# EAGLE design LuMini_2Inch (EAGLE 9.1.0)
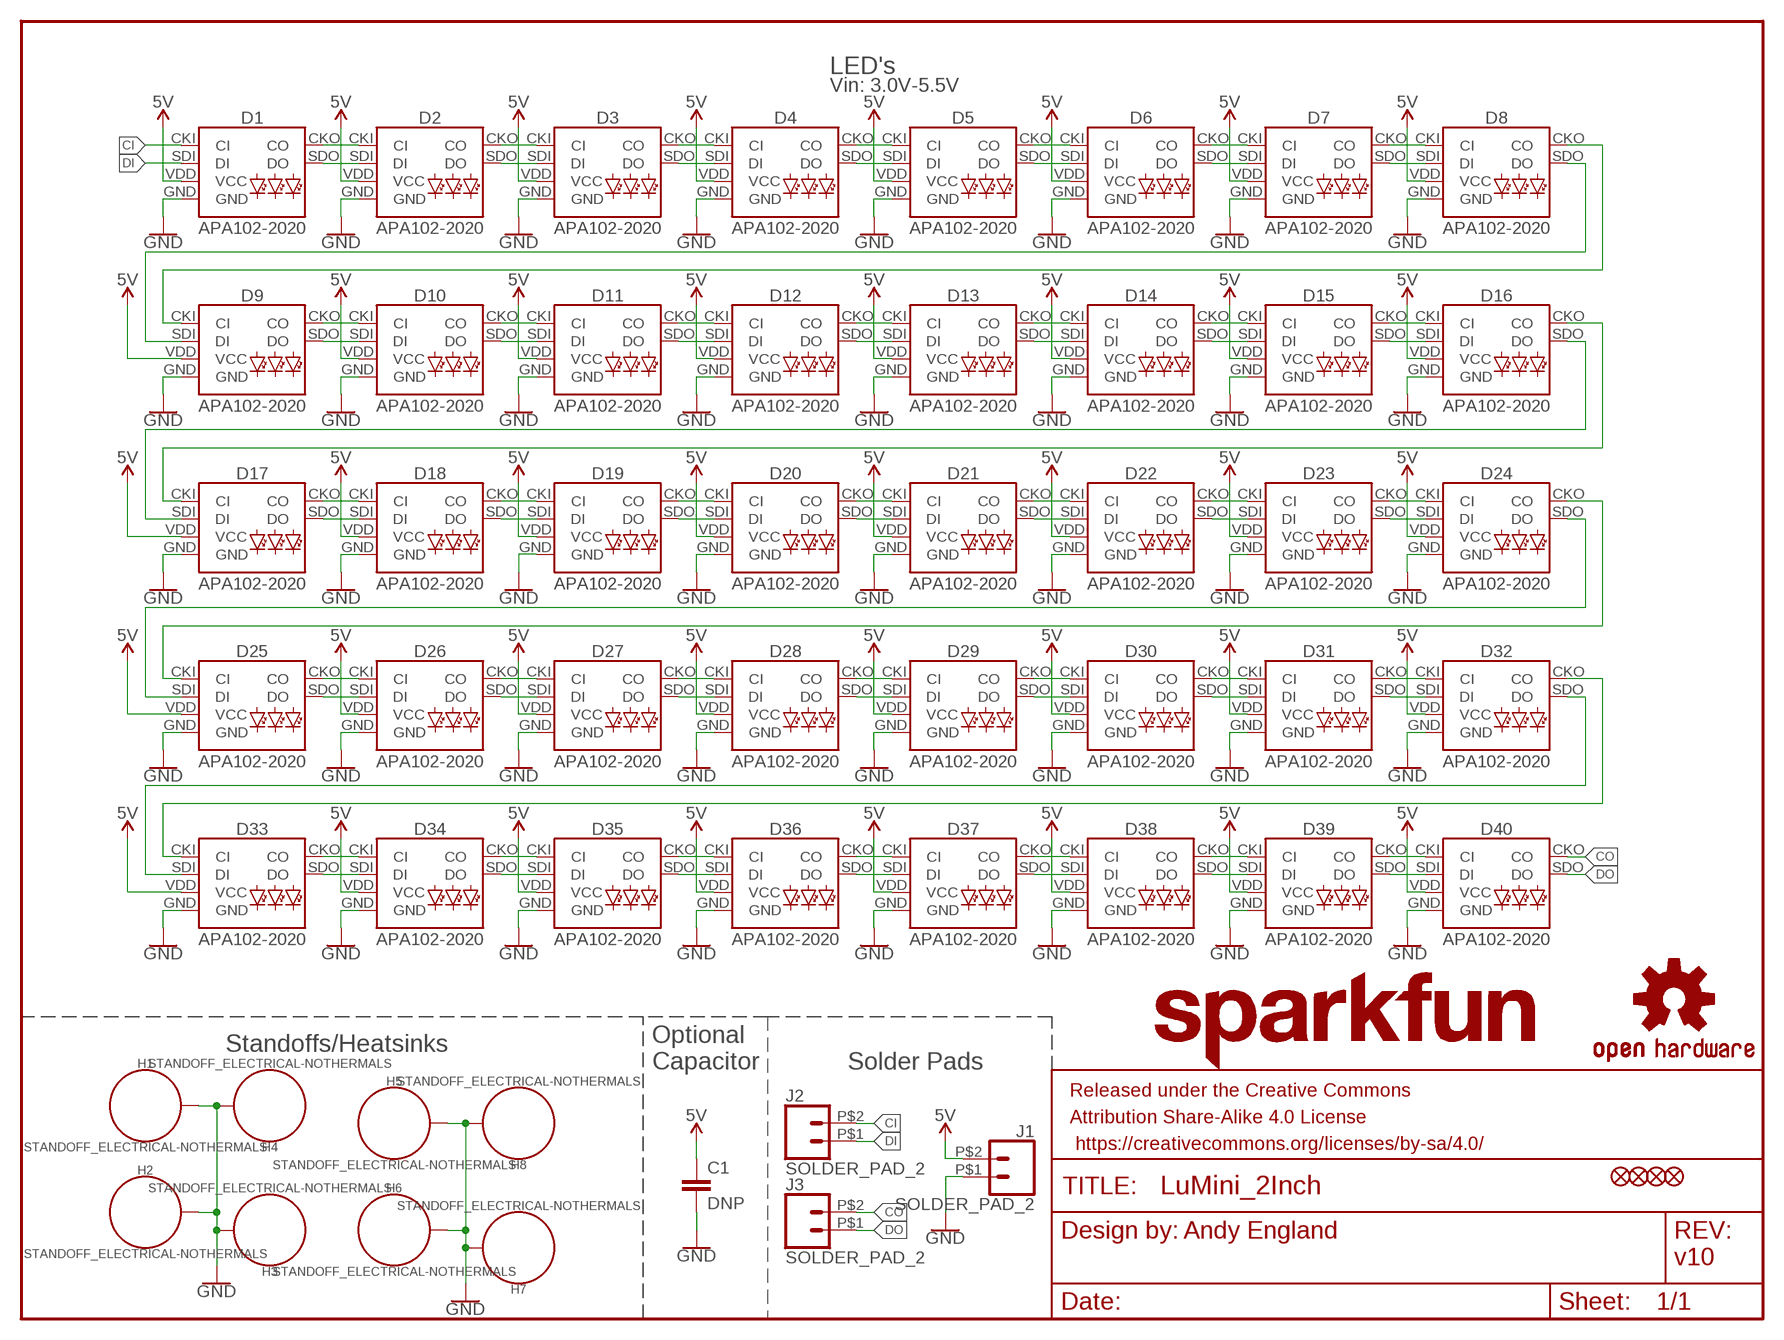
[diagram p0: schematic, sheet 1]

## Parts
C1  DNP  4.7UF-1206-16V-(+80/-20%)  [1206]
D1  APA102-2020  [APA102-2020]
D2  APA102-2020  [APA102-2020]
D3  APA102-2020  [APA102-2020]
D4  APA102-2020  [APA102-2020]
D5  APA102-2020  [APA102-2020]
D6  APA102-2020  [APA102-2020]
D7  APA102-2020  [APA102-2020]
D8  APA102-2020  [APA102-2020]
D9  APA102-2020  [APA102-2020]
D10  APA102-2020  [APA102-2020]
D11  APA102-2020  [APA102-2020]
D12  APA102-2020  [APA102-2020]
D13  APA102-2020  [APA102-2020]
D14  APA102-2020  [APA102-2020]
D15  APA102-2020  [APA102-2020]
D16  APA102-2020  [APA102-2020]
D17  APA102-2020  [APA102-2020]
D18  APA102-2020  [APA102-2020]
D19  APA102-2020  [APA102-2020]
D20  APA102-2020  [APA102-2020]
D21  APA102-2020  [APA102-2020]
D22  APA102-2020  [APA102-2020]
D23  APA102-2020  [APA102-2020]
D24  APA102-2020  [APA102-2020]
D25  APA102-2020  [APA102-2020]
D26  APA102-2020  [APA102-2020]
D27  APA102-2020  [APA102-2020]
D28  APA102-2020  [APA102-2020]
D29  APA102-2020  [APA102-2020]
D30  APA102-2020  [APA102-2020]
D31  APA102-2020  [APA102-2020]
D32  APA102-2020  [APA102-2020]
D33  APA102-2020  [APA102-2020]
D34  APA102-2020  [APA102-2020]
D35  APA102-2020  [APA102-2020]
D36  APA102-2020  [APA102-2020]
D37  APA102-2020  [APA102-2020]
D38  APA102-2020  [APA102-2020]
D39  APA102-2020  [APA102-2020]
D40  APA102-2020  [APA102-2020]
FD1  FIDUCIALUFIDUCIAL  [FIDUCIAL-MICRO]
FD2  FIDUCIALUFIDUCIAL  [FIDUCIAL-MICRO]
FD3  FIDUCIALUFIDUCIAL  [FIDUCIAL-MICRO]
FD4  FIDUCIALUFIDUCIAL  [FIDUCIAL-MICRO]
FRAME1  FRAME-LETTER  [CREATIVE_COMMONS]
H1  STANDOFF_ELECTRICAL-NOTHERMALS  [STANDOFF-ELECTRICAL-NOTHERMALS]
H2  STANDOFF_ELECTRICAL-NOTHERMALS  [STANDOFF-ELECTRICAL-NOTHERMALS]
H3  STANDOFF_ELECTRICAL-NOTHERMALS  [STANDOFF-ELECTRICAL-NOTHERMALS]
H4  STANDOFF_ELECTRICAL-NOTHERMALS  [STANDOFF-ELECTRICAL-NOTHERMALS]
H5  STANDOFF_ELECTRICAL-NOTHERMALS  [STANDOFF-ELECTRICAL-NOTHERMALS]
H6  STANDOFF_ELECTRICAL-NOTHERMALS  [STANDOFF-ELECTRICAL-NOTHERMALS]
H7  STANDOFF_ELECTRICAL-NOTHERMALS  [STANDOFF-ELECTRICAL-NOTHERMALS]
H8  STANDOFF_ELECTRICAL-NOTHERMALS  [STANDOFF-ELECTRICAL-NOTHERMALS]
J1  SOLDER_PAD_2  [SOLDER_PAD_2]
J2  SOLDER_PAD_2  [SOLDER_PAD_2]
J3  SOLDER_PAD_2  [SOLDER_PAD_2]
LOGO1  OSHW-LOGOS  [OSHW-LOGO-S]
LOGO2  SFE_LOGO_NAME.1_INCH  [SFE_LOGO_NAME_.1]

## Nets
5V: C1.1 D1.VDD(VCC) D2.VDD(VCC) D3.VDD(VCC) D4.VDD(VCC) D5.VDD(VCC) D6.VDD(VCC) D7.VDD(VCC) D8.VDD(VCC) D9.VDD(VCC) D10.VDD(VCC) D11.VDD(VCC) D12.VDD(VCC) D13.VDD(VCC) D14.VDD(VCC) D15.VDD(VCC) D16.VDD(VCC) D17.VDD(VCC) D18.VDD(VCC) D19.VDD(VCC) D20.VDD(VCC) D21.VDD(VCC) D22.VDD(VCC) D23.VDD(VCC) D24.VDD(VCC) D25.VDD(VCC) D26.VDD(VCC) D27.VDD(VCC) D28.VDD(VCC) D29.VDD(VCC) D30.VDD(VCC) D31.VDD(VCC) D32.VDD(VCC) D33.VDD(VCC) D34.VDD(VCC) D35.VDD(VCC) D36.VDD(VCC) D37.VDD(VCC) D38.VDD(VCC) D39.VDD(VCC) D40.VDD(VCC) J1.P$2
CI: D1.CKI(CI) J2.P$2
CO: D40.CKO(CO) J3.P$2
DI: D1.SDI(DI) J2.P$1
DO: D40.SDO(DO) J3.P$1
GND: C1.2 D1.GND D2.GND D3.GND D4.GND D5.GND D6.GND D7.GND D8.GND D9.GND D10.GND D11.GND D12.GND D13.GND D14.GND D15.GND D16.GND D17.GND D18.GND D19.GND D20.GND D21.GND D22.GND D23.GND D24.GND D25.GND D26.GND D27.GND D28.GND D29.GND D30.GND D31.GND D32.GND D33.GND D34.GND D35.GND D36.GND D37.GND D38.GND D39.GND D40.GND H1.P1 H2.P1 H3.P1 H4.P1 H5.P1 H6.P1 H7.P1 H8.P1 J1.P$1
N$1: D4.CKO(CO) D5.CKI(CI)
N$4: D1.CKO(CO) D2.CKI(CI)
N$5: D1.SDO(DO) D2.SDI(DI)
N$6: D2.CKO(CO) D3.CKI(CI)
N$7: D2.SDO(DO) D3.SDI(DI)
N$8: D3.CKO(CO) D4.CKI(CI)
N$9: D3.SDO(DO) D4.SDI(DI)
N$10: D4.SDO(DO) D5.SDI(DI)
N$11: D5.CKO(CO) D6.CKI(CI)
N$12: D5.SDO(DO) D6.SDI(DI)
N$13: D6.CKO(CO) D7.CKI(CI)
N$14: D6.SDO(DO) D7.SDI(DI)
N$15: D7.CKO(CO) D8.CKI(CI)
N$16: D7.SDO(DO) D8.SDI(DI)
N$17: D24.CKO(CO) D25.CKI(CI)
N$19: D9.CKO(CO) D10.CKI(CI)
N$20: D9.SDO(DO) D10.SDI(DI)
N$21: D10.CKO(CO) D11.CKI(CI)
N$22: D10.SDO(DO) D11.SDI(DI)
N$23: D11.CKO(CO) D12.CKI(CI)
N$24: D11.SDO(DO) D12.SDI(DI)
N$25: D12.CKO(CO) D13.CKI(CI)
N$26: D12.SDO(DO) D13.SDI(DI)
N$27: D13.CKO(CO) D14.CKI(CI)
N$28: D13.SDO(DO) D14.SDI(DI)
N$29: D14.CKO(CO) D15.CKI(CI)
N$30: D14.SDO(DO) D15.SDI(DI)
N$31: D15.CKO(CO) D16.CKI(CI)
N$32: D15.SDO(DO) D16.SDI(DI)
N$35: D17.CKO(CO) D18.CKI(CI)
N$36: D17.SDO(DO) D18.SDI(DI)
N$37: D18.CKO(CO) D19.CKI(CI)
N$38: D18.SDO(DO) D19.SDI(DI)
N$39: D19.CKO(CO) D20.CKI(CI)
N$40: D19.SDO(DO) D20.SDI(DI)
N$41: D20.CKO(CO) D21.CKI(CI)
N$42: D20.SDO(DO) D21.SDI(DI)
N$43: D16.SDO(DO) D17.SDI(DI)
N$44: D16.CKO(CO) D17.CKI(CI)
N$45: D8.SDO(DO) D9.SDI(DI)
N$47: D24.SDO(DO) D25.SDI(DI)
N$48: D21.CKO(CO) D22.CKI(CI)
N$49: D21.SDO(DO) D22.SDI(DI)
N$50: D22.CKO(CO) D23.CKI(CI)
N$51: D22.SDO(DO) D23.SDI(DI)
N$52: D23.CKO(CO) D24.CKI(CI)
N$53: D23.SDO(DO) D24.SDI(DI)
N$54: D32.SDO(DO) D33.SDI(DI)
N$55: D32.CKO(CO) D33.CKI(CI)
N$56: D25.CKO(CO) D26.CKI(CI)
N$57: D25.SDO(DO) D26.SDI(DI)
N$58: D26.CKO(CO) D27.CKI(CI)
N$59: D26.SDO(DO) D27.SDI(DI)
N$60: D27.CKO(CO) D28.CKI(CI)
N$61: D27.SDO(DO) D28.SDI(DI)
N$62: D28.CKO(CO) D29.CKI(CI)
N$63: D28.SDO(DO) D29.SDI(DI)
N$66: D29.CKO(CO) D30.CKI(CI)
N$67: D29.SDO(DO) D30.SDI(DI)
N$68: D30.CKO(CO) D31.CKI(CI)
N$69: D30.SDO(DO) D31.SDI(DI)
N$70: D31.CKO(CO) D32.CKI(CI)
N$71: D31.SDO(DO) D32.SDI(DI)
N$74: D33.CKO(CO) D34.CKI(CI)
N$75: D33.SDO(DO) D34.SDI(DI)
N$76: D34.CKO(CO) D35.CKI(CI)
N$77: D34.SDO(DO) D35.SDI(DI)
N$78: D35.CKO(CO) D36.CKI(CI)
N$79: D35.SDO(DO) D36.SDI(DI)
N$80: D36.CKO(CO) D37.CKI(CI)
N$81: D36.SDO(DO) D37.SDI(DI)
N$84: D37.CKO(CO) D38.CKI(CI)
N$85: D37.SDO(DO) D38.SDI(DI)
N$86: D38.CKO(CO) D39.CKI(CI)
N$87: D38.SDO(DO) D39.SDI(DI)
N$88: D39.CKO(CO) D40.CKI(CI)
N$89: D39.SDO(DO) D40.SDI(DI)
N$98: D8.CKO(CO) D9.CKI(CI)

## Notes on the sheet
- LED's
- Vin: 3.0V-5.5V
- Standoffs/Heatsinks
- Optional
  Capacitor
- Solder Pads
- Andy England
- v10

## Library data of the parts
C1 = SparkFun-Capacitors:4.7UF: 4.7µF ceramic capacitors A capacitor is a passive two-terminal electrical component used to store electrical energy temporarily in an electric field.; PROD_ID: CAP-10300; VALUE: 4.7uF
D1-D40 = SparkFun-LED:APA102: APA102 Addressable RGB LED Used in manufacturing of various products at SparkFun Packages: 5050 2020 SparkFun Products: SparkFun Lumenati Boards <https://www.sparkfun.com/categories/405>; PROD_ID: DIO-13883
FD1-FD4 = SparkFun-Aesthetics:FIDUCIAL: Fiducial Alignment Points Point-of-reference for pick-and-place machines and other optical instruments.
FRAME1 = SparkFun-Aesthetics:FRAME-LETTER: Schematic Frame - Letter Standard 8.5x11 US Letter frame
H1-H8 = SparkFun-Hardware:STANDOFF_ELECTRICAL: Stand Off Drill holes with an electrical connection. For example, use these to ground your board to a chassis. Example SparkFun Products Screw - Phillips Head (1/4", 4-40, 10 pack) <https://www.sparkfun.com/products/10453> (PRT-10453) Screw - Phillips Head (1/2", 4-40, 10 pack) <https://www.sparkfun.com/products/10452> (PRT-10452) Screw - Phillips Head (3/4", 4-40, 10 pack) <https://www.sparkfun.com/products/10451> (PRT-10451) Screw - Phillips Head (1", 4-40, 10 pack) <https://www.sparkfun.com/products/10450> (PRT-10450)
J1-J3 = SparkFun-Connectors:SOLDER_PAD_2: Solder Pad for LuMini Rings
LOGO1 = SparkFun-Aesthetics:OSHW-LOGO: Open-Source Hardware (OSHW) Logo This logo indicates the piece of hardware it is found on incorporates a OSHW license and/or adheres to the definition of open source hardware found here: http://freedomdefined.org/OSHW
LOGO2 = SparkFun-Aesthetics:SFE_LOGO_NAME: SparkFun Font Logo This is the SparkFun name logo. The logo on the schematic will always be the same size; the package variant is the height of the flame part of the logo (or the height the flame would be, if it were drawn). Default layer for the logo on the board is tSilk.

## Board
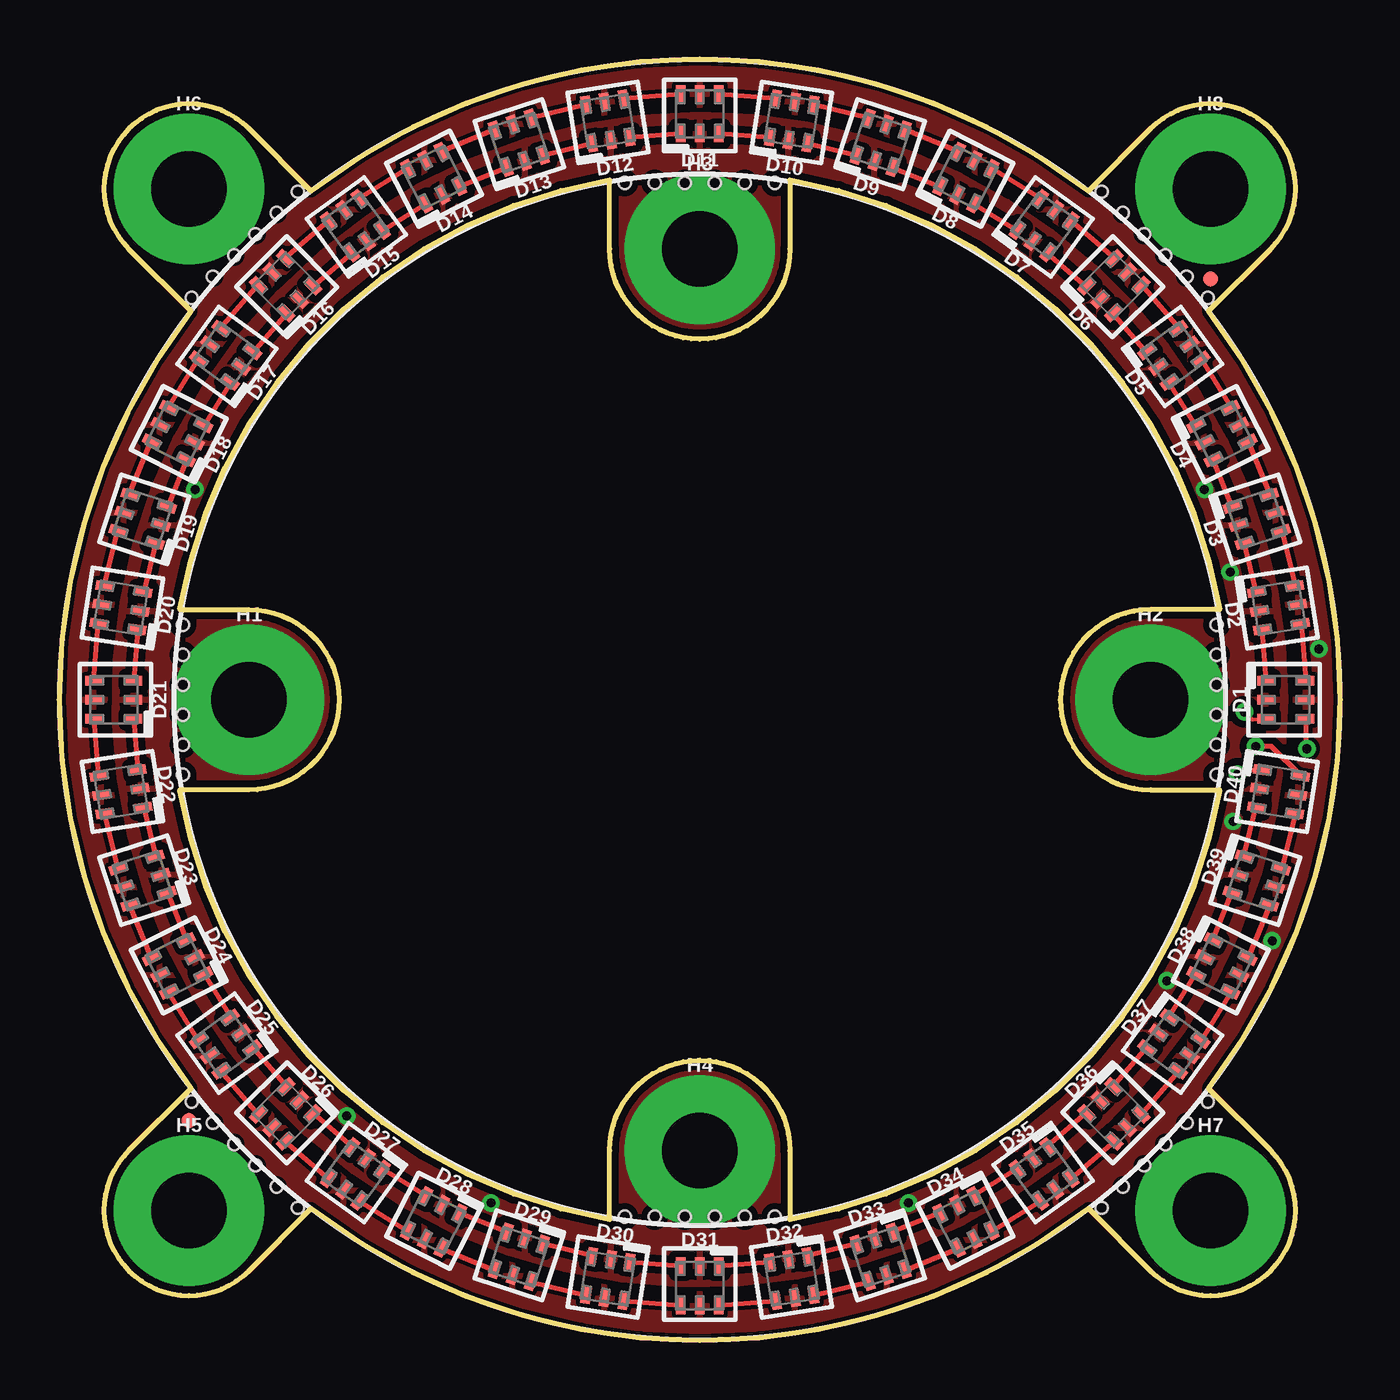
[diagram p1: board, top side]
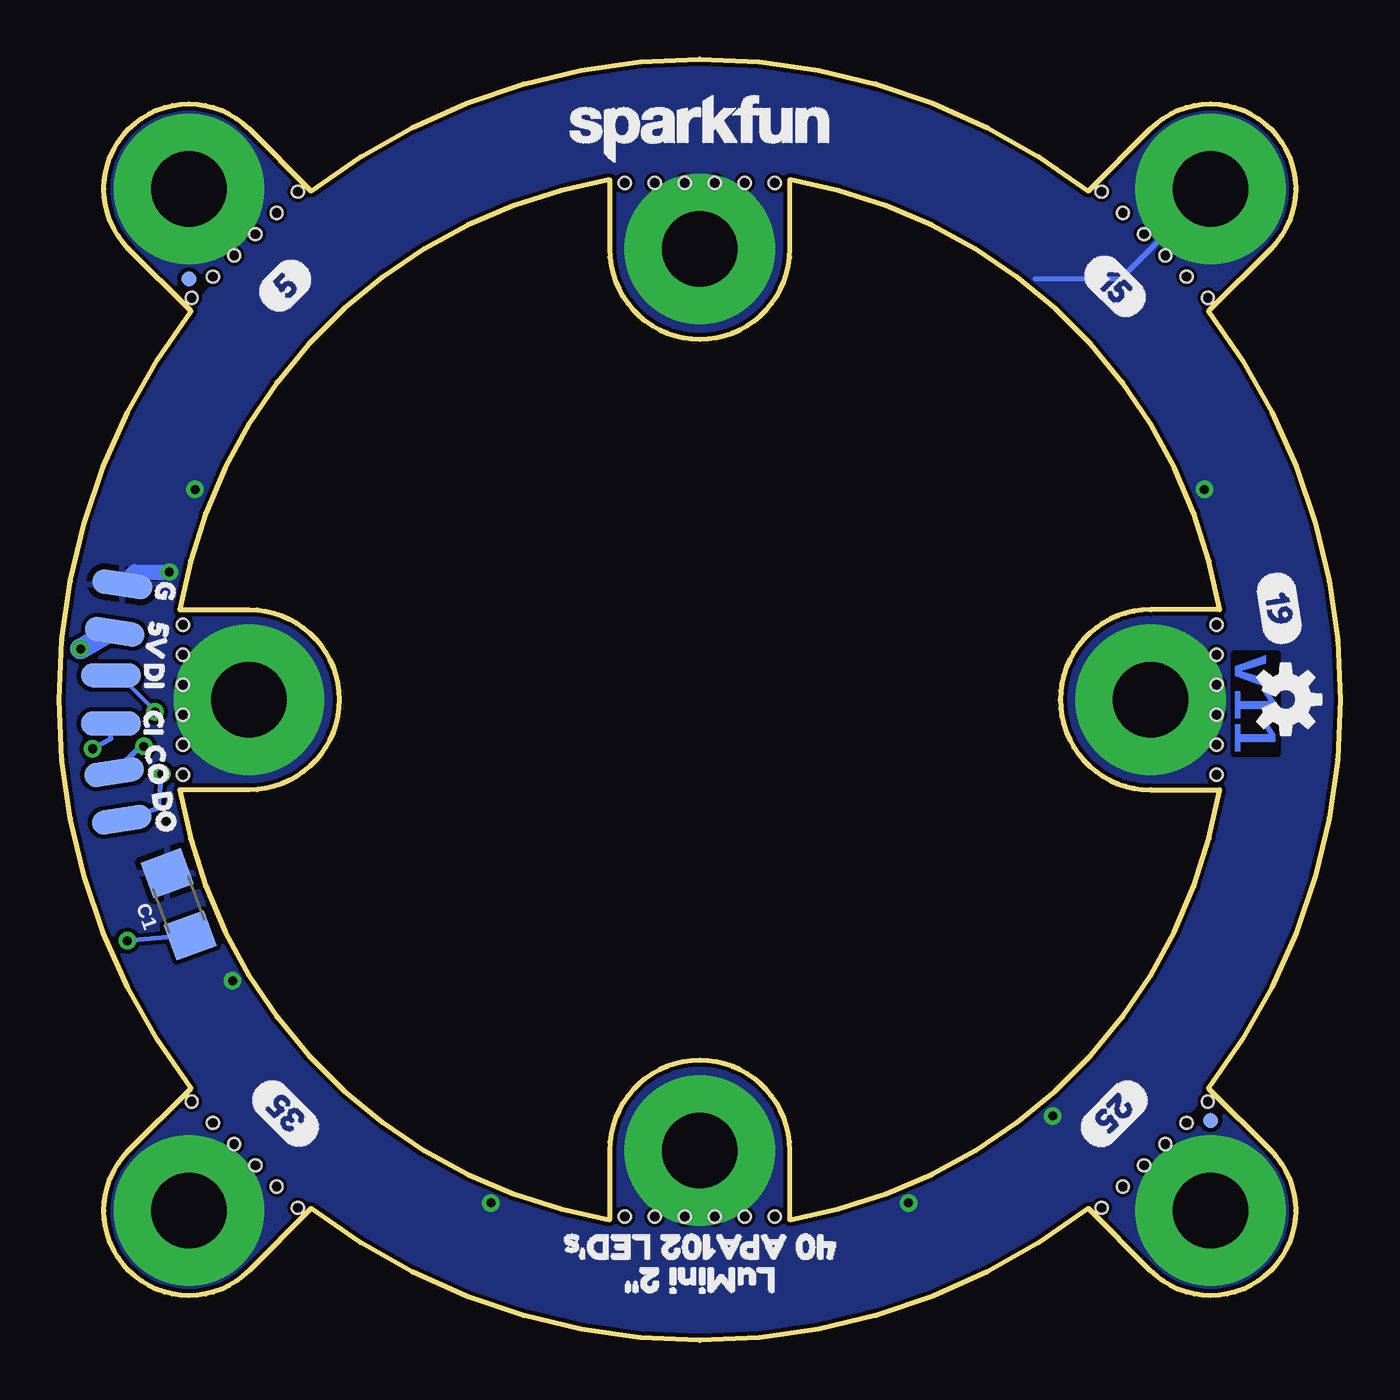
[diagram p2: board, bottom side, seen from below]

Size 54.15 x 54.15 mm. Coordinates in mm from the lower left corner, seen from the top.
Outline: 5.1,30.89 8.03,30.89 arc-90 11.84,27.08 arc-90 8.03,23.27 5.1,23.27 arc71 23.27,5.1 23.27,8.03 arc-90 27.08,11.84 arc-90 30.89,8.03 30.89,5.1 arc71 49.05,23.27 46.13,23.27 arc-90 42.32,27.08 arc-90 46.13,30.89 49.05,30.89 arc71 30.89,49.05 30.89,46.13 arc-90 27.08,42.32 arc-90 23.27,46.13 23.27,49.05 arc71 5.1,30.89
Outline: 10.65,48.58 8.03,51.21 arc180 2.95,46.13 5.57,43.5 arc75 5.57,10.65 2.95,8.03 arc180 8.03,2.95 10.65,5.57 arc75 43.5,5.57 46.13,2.95 arc180 51.21,8.03 48.58,10.65 arc75 48.58,43.5 51.21,46.13 arc180 46.13,51.21 43.5,48.58 arc75 10.65,48.58
Copper layers (1*16): Top 0.035mm / dielectric 1.5mm / Bottom 0.035mm
Design rules "SparkFun-2-layer-TIGHT": minimum track width 7mil, minimum drill 15mil, track to track 7mil, track to pad 7mil, pad to pad 7mil, via to via 7mil, smd to smd 7mil, copper to edge 7mil, drill to drill 7mil, minimum pad ring 7mil, minimum via ring 7mil, stop-mask expansion 4mil, vias tented up to drill 25mil, thermal gap 10mil
Holes 0.51 mm at 48.92,26.44 48.92,25.17 48.92,23.9 48.92,27.71 48.92,28.98 48.92,30.25 27.71,48.92 28.98,48.92 30.25,48.92 26.44,48.92 25.17,48.92 23.9,48.92 5.23,27.71 5.23,28.98 5.23,30.25 5.23,26.44 5.23,25.17 5.23,23.9 26.44,5.23 25.17,5.23 23.9,5.23 27.71,5.23 28.98,5.23 30.25,5.23 7.4,8.29 6.5,9.19 5.6,10.09 8.29,7.4 9.19,6.5 10.09,5.6 45.86,7.4 44.96,6.5 44.06,5.6 46.75,8.29 47.65,9.19 48.55,10.09 46.75,45.86 47.65,44.96 48.55,44.06 45.86,46.75 44.96,47.65 44.06,48.55 8.29,46.75 9.19,47.65 10.09,48.55 7.4,45.86 6.5,44.96 5.6,44.06

### Footprints (pad centres in the part's own frame; a part is rotated, then mirrored left to right if it is on the bottom)
1206 = smd 1.6 x 1.8: 1 -1.4,0; 2 1.4,0
APA102-2020 = smd 0.4 x 0.7: CKI -0.8,-0.85; CKO 0.8,-0.85; GND 0,0.85; SDI -0.8,0.85; SDO 0.8,0.85; VDD 0,-0.85
FIDUCIAL-MICRO = smd 0.635 x 0.635: 1 0,0
STANDOFF-ELECTRICAL-NOTHERMALS = drill 3.2 pad 6.35: P1 0,0
SOLDER_PAD_2 = smd 1.016 x 2.54: P$1 -1.016,0; P$2 1.016,0

### Placement (x,y rotation side)
C1  49.1,18.43 110 bottom
D1  51.84,27.08 90 top
D2  51.54,30.96 99 top
D3  50.62,34.72 108 top
D4  49.15,38.33 117 top
D5  47.12,41.63 126 top
D6  44.58,44.58 135 top
D7  41.63,47.12 144 top
D8  38.33,49.15 153 top
D9  34.72,50.62 162 top
D10  30.96,51.54 171 top
D11  27.08,51.84 180 top
D12  23.19,51.54 189 top
D13  19.43,50.62 198 top
D14  15.82,49.15 207 top
D15  12.52,47.12 216 top
D16  9.57,44.58 225 top
D17  7.03,41.63 234 top
D18  5,38.33 243 top
D19  3.53,34.72 252 top
D20  2.62,30.96 261 top
D21  2.31,27.08 270 top
D22  2.62,23.19 279 top
D23  3.53,19.43 288 top
D24  5,15.82 297 top
D25  7.03,12.52 306 top
D26  9.57,9.57 315 top
D27  12.52,7.03 324 top
D28  15.82,5 333 top
D29  19.43,3.53 342 top
D30  23.19,2.62 351 top
D31  27.08,2.31 0 top
D32  30.96,2.62 9 top
D33  34.72,3.53 18 top
D34  38.33,5 27 top
D35  41.63,7.03 36 top
D36  44.58,9.57 45 top
D37  47.12,12.52 54 top
D38  49.15,15.82 63 top
D39  50.62,19.43 72 top
D40  51.54,23.19 81 top
FD1  5.49,9.3 0 top
FD2  5.49,9.3 0 bottom
FD3  48.67,44.86 0 top
FD4  48.67,44.86 0 bottom
FRAME1  2.95,-7.21 0 top  (outside the outline)
H1  8.03,27.08 0 top
H2  46.13,27.08 0 top
H3  27.08,46.13 0 top
H4  27.08,8.03 0 top
H5  5.49,5.49 0 top
H6  5.49,48.67 0 top
H7  48.67,5.49 0 top
H8  48.67,48.67 0 top
J1  51.64,30.95 261 bottom
J2  51.97,27.09 270 bottom
J3  51.66,23.01 99 bottom
LOGO1  2.31,27.09 270 bottom
LOGO2  27.08,51.21 0 bottom
U$1  [LUMINI_2#0]  22.95,2.54 180 bottom
U$2  [54]  45.63,43.55 45 bottom
U$3  [156]  10.64,45.67 315 bottom
U$4  [5V6]  49.81,31.08 262 bottom
U$5  [G4]  49.49,32.79 262 bottom
U$6  [194]  2.83,32.5 279 bottom
U$7  [DO3]  49.94,23.9 279 bottom
U$8  [CO1]  50.25,25.87 279 bottom
U$9  [CI6]  50.15,27.37 270 bottom
U$10  [DI4]  50.13,29.36 270 bottom
U$11  [40_APA102_LED#S1]  20.41,3.94 180 bottom
U$12  [258]  8.33,10.81 225 bottom
U$13  [3510]  43.38,8.38 135 bottom
U$14  [ORDERING_INSTRUCTIONS]  -11.02,-11.02 0 top  (outside the outline)

### Tracks (layer width: path | path; a pad name or v marks a point on that pad's centre or on a via)
5V  (via drill 0.38)
  Bottom 0.203: C1.1 v51.27,16.89
  Bottom 0.889: v53.24,29.23 52.01,29.95 J1.P$2
  pour Top (rank 2): 27.08,54.13 arc90 0.02,27.08 arc270 27.14,54.13 arc179
CI  (via drill 0.38)
  Top 0.203: D1.CKI 52.69,25.06 v52.74,25.01
  Bottom 0.203: v52.74,25.01 51.97,25.42 J2.P$2
CO  (via drill 0.38)
  Top 0.203: D40.CKO 51.24,25.11 v50.57,25.11
  Bottom 0.203: v50.57,25.11 50.73,25.11 J3.P$2
DI  (via drill 0.38)
  Top 0.178: v50.1,26.57 50.44,26.23 D1.SDI
  Bottom 0.178: v50.1,26.57 50.1,26.61 51.6,28.1 J2.P$1
DO  (via drill 0.38)
  Top 0.178: D40.SDO 50.45,24.11 49.9,23.93 v49.81,23.94
  Bottom 0.203: J3.P$1 49.94,22.5 v49.81,23.94
GND  (via drill 0.38)
  Bottom 0.203: C1.2 49.24,19.85 49.22,19.87 | H6.P1 9.3,44.86 12.9,44.86
  Bottom 0.635: v49.49,32.47 50.96,32.47 J1.P$1
  other vias: 48.41,35.97 5.74,35.97 49.62,21.93 46.82,15.2 35.9,5.8 18.25,5.8 12.15,9.49
  pour Bottom: 27.08,54.13 arc-90 54.13,27.08 arc-270 27.01,54.13 arc-179
  pour Top (isolate 0.305): 27.08,51.84 arc-90 51.84,27.08 arc-270
  pour Bottom: 5.57,43.5 2.95,46.13 arc-180 8.03,51.21 10.65,48.58
  pour Bottom: 43.5,48.58 46.13,51.21 arc-180 51.21,46.13 48.58,43.5
  pour Bottom: 48.58,10.65 51.21,8.03 arc-180 46.13,2.95 43.5,5.57
  pour Bottom: 10.65,5.57 8.03,2.95 arc-180 2.95,8.03 5.57,10.65
N$1
  Top 0.203: D5.CKI D4.CKO
N$4
  Top 0.203: D2.CKI D1.CKO
N$5
  Top 0.203: D2.SDI D1.SDO
N$6
  Top 0.203: D3.CKI D2.CKO
N$7
  Top 0.203: D3.SDI D2.SDO
N$8
  Top 0.203: D3.CKO D4.CKI
N$9
  Top 0.203: D4.SDI D3.SDO
N$10
  Top 0.203: D5.SDI D4.SDO
N$11
  Top 0.203: D6.CKI D5.CKO
N$12
  Top 0.203: D5.SDO D6.SDI
N$13
  Top 0.203: D7.CKI D6.CKO
N$14
  Top 0.203: D7.SDI D6.SDO
N$15
  Top 0.203: D8.CKI D7.CKO
N$16
  Top 0.203: D7.SDO D8.SDI
N$17
  Top 0.203: D25.CKI D24.CKO
N$19
  Top 0.203: D10.CKI D9.CKO
N$20
  Top 0.203: D9.SDO D10.SDI
N$21
  Top 0.203: D11.CKI D10.CKO
N$22
  Top 0.203: D10.SDO D11.SDI
N$23
  Top 0.203: D12.CKI D11.CKO
N$24
  Top 0.203: D11.SDO D12.SDI
N$25
  Top 0.203: D13.CKI D12.CKO
N$26
  Top 0.203: D12.SDO D13.SDI
N$27
  Top 0.203: D14.CKI D13.CKO
N$28
  Top 0.203: D13.SDO D14.SDI
N$29
  Top 0.203: D15.CKI D14.CKO
N$30
  Top 0.203: D14.SDO D15.SDI
N$31
  Top 0.203: D16.CKI D15.CKO
N$32
  Top 0.203: D15.SDO D16.SDI
N$35
  Top 0.203: D18.CKI D17.CKO
N$36
  Top 0.203: D17.SDO D18.SDI
N$37
  Top 0.203: D19.CKI D18.CKO
N$38
  Top 0.203: D18.SDO D19.SDI
N$39
  Top 0.203: D20.CKI D19.CKO
N$40
  Top 0.203: D19.SDO D20.SDI
N$41
  Top 0.203: D21.CKI D20.CKO
N$42
  Top 0.203: D20.SDO D21.SDI
N$43
  Top 0.203: D16.SDO D17.SDI
N$44
  Top 0.203: D17.CKI D16.CKO
N$45
  Top 0.203: D9.SDI D8.SDO
N$47
  Top 0.203: D24.SDO D25.SDI
N$48
  Top 0.203: D21.CKO D22.CKI
N$49
  Top 0.203: D21.SDO D22.SDI
N$50
  Top 0.203: D22.CKO D23.CKI
N$51
  Top 0.203: D22.SDO D23.SDI
N$52
  Top 0.203: D23.CKO D24.CKI
N$53
  Top 0.203: D24.SDI D23.SDO
N$54
  Top 0.203: D33.SDI D32.SDO
N$55
  Top 0.203: D32.CKO D33.CKI
N$56
  Top 0.203: D25.CKO D26.CKI
N$57
  Top 0.203: D26.SDI D25.SDO
N$58
  Top 0.203: D27.CKI D26.CKO
N$59
  Top 0.203: D26.SDO D27.SDI
N$60
  Top 0.203: D28.CKI D27.CKO
N$61
  Top 0.203: D27.SDO D28.SDI
N$62
  Top 0.203: D28.CKO D29.CKI
N$63
  Top 0.203: D28.SDO D29.SDI
N$66
  Top 0.203: D29.CKO D30.CKI
N$67
  Top 0.203: D30.SDI D29.SDO
N$68
  Top 0.203: D31.CKI D30.CKO
N$69
  Top 0.203: D30.SDO D31.SDI
N$70
  Top 0.203: D32.CKI D31.CKO
N$71
  Top 0.203: D31.SDO D32.SDI
N$74
  Top 0.203: D33.CKO D34.CKI
N$75
  Top 0.203: D34.SDI D33.SDO
N$76
  Top 0.203: D34.CKO D35.CKI
N$77
  Top 0.203: D35.SDI D34.SDO
N$78
  Top 0.203: D36.CKI D35.CKO
N$79
  Top 0.203: D36.SDI D35.SDO
N$80
  Top 0.203: D36.CKO D37.CKI
N$81
  Top 0.203: D37.SDI D36.SDO
N$84
  Top 0.203: D38.CKI D37.CKO
N$85
  Top 0.203: D38.SDI D37.SDO
N$86
  Top 0.203: D38.CKO D39.CKI
N$87
  Top 0.203: D38.SDO D39.SDI
N$88
  Top 0.203: D40.CKI D39.CKO
N$89
  Top 0.203: D39.SDO D40.SDI
N$98
  Top 0.203: D9.CKI D8.CKO

### Text on the board
Bottom: v11
Dimension: Andy England
tDocu: Black PCB / 2 Oz. Cu